# Altium project Mainboard.PrjPcb
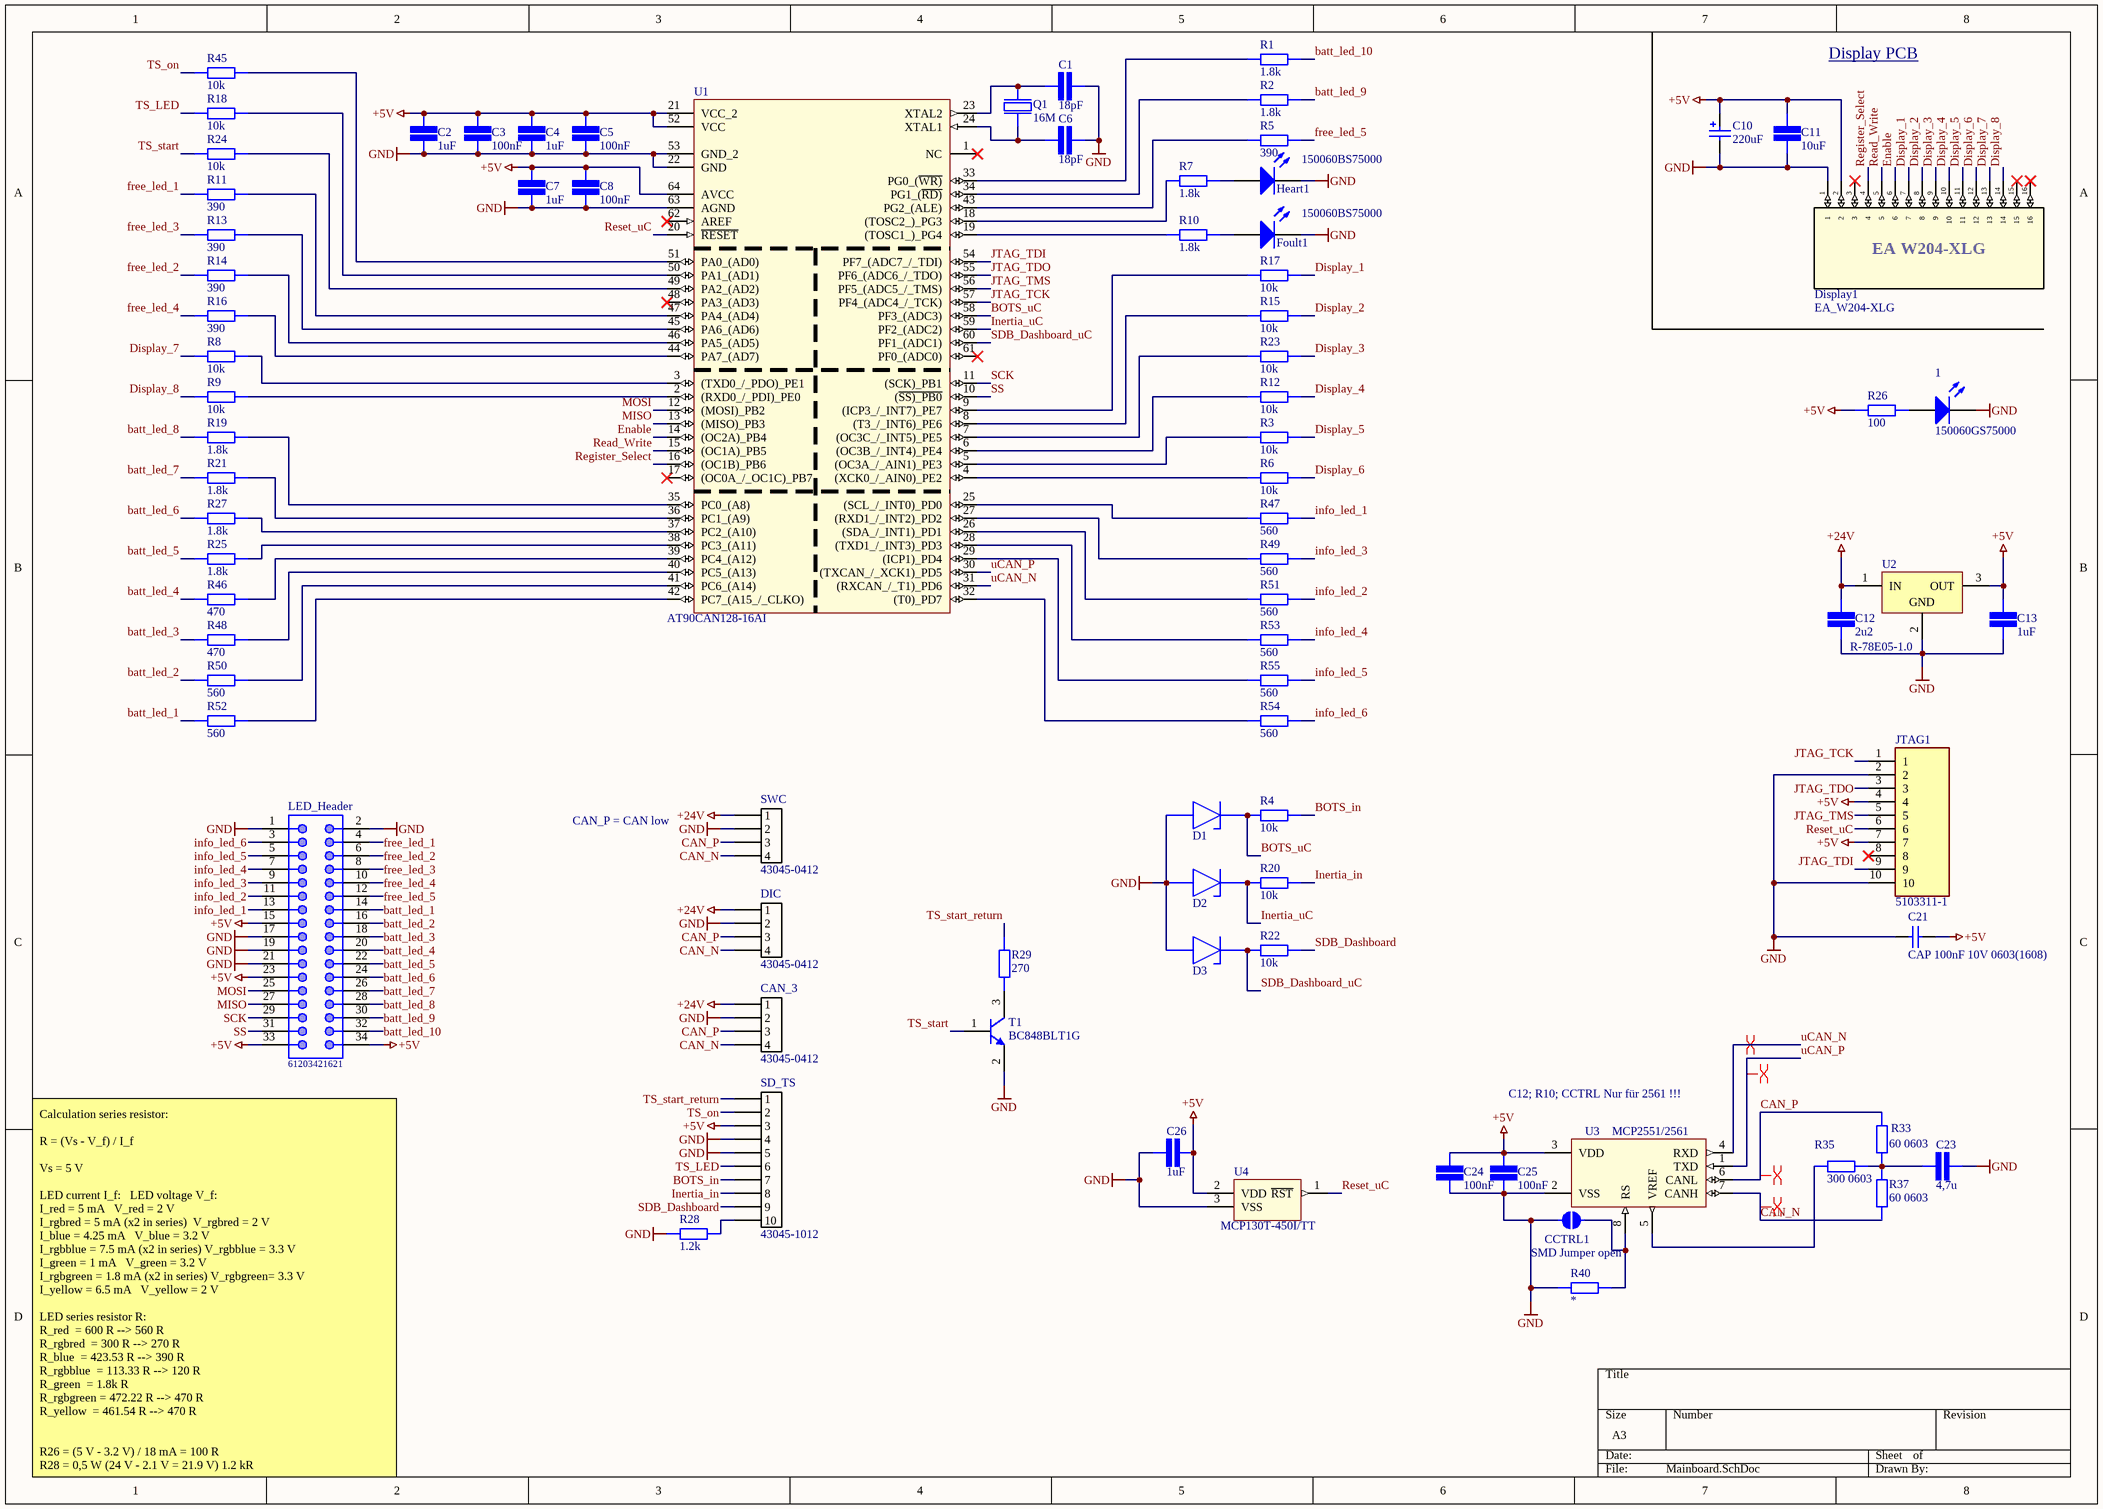
[diagram p0: Mainboard.SchDoc]
1 sheet, 81 parts. Net scope: global (net labels, ports and power ports of the same name join across sheets).
Board file: Mainboard.PcbDoc

## Sheet Mainboard.SchDoc
size A3; SheetNumber: 1; SheetTotal: 1

### Parts
1  150060GS75000  [0603_A]
C1  value 18pF  [CAP 0603/1608]  (hidden comment: SMD Capacitor)
C2  value 1uF  [CAP 0603/1608]  (hidden comment: SMD Capacitor)
C3  value 100nF  [CAP 0603/1608]  (hidden comment: SMD Capacitor)
C4  value 1uF  [CAP 0603/1608]  (hidden comment: SMD Capacitor)
C5  value 100nF  [CAP 0603/1608]  (hidden comment: SMD Capacitor)
C6  value 18pF  [CAP 0603/1608]  (hidden comment: SMD Capacitor)
C7  value 1uF  [CAP 0603/1608]  (hidden comment: SMD Capacitor)
C8  value 100nF  [CAP 0603/1608]  (hidden comment: SMD Capacitor)
C10  value 220uF  [WCAP-ASLL_6.3x7.7]  (hidden comment: 865060145006)
C11  value 10uF  [CAP 0603/1608]  (hidden comment: SMD Capacitor)
C12  value 2u2  [CAP 0603/1608]  (hidden comment: SMD Capacitor)
C13  value 1uF  [CAP 0603/1608]  (hidden comment: SMD Capacitor)
C21  CAP 100nF 10V 0603(1608)  [CAPC0603(1608)100_L]
C23  value 4,7u  [CAP 0603/1608]  (hidden comment: SMD Capacitor)
C24  value 100nF  [CAP 0603/1608]  (hidden comment: SMD Capacitor)
C25  value 100nF  [CAP 0603/1608]  (hidden comment: SMD Capacitor)
C26  value 1uF  [CAP 0603/1608]  (hidden comment: SMD Capacitor)
CAN_3  43045-0412  [43045-0412]
CCTRL1  SMD Jumper open  [SMD-JUMPER-OPEN]  (no BOM)
D1  MM3Z4V7T1G  [SOD-323-2]  (value not drawn)
D2  MM3Z4V7T1G  [SOD-323-2]  (value not drawn)
D3  MM3Z4V7T1G  [SOD-323-2]  (value not drawn)
DIC  43045-0412  [43045-0412]
Display1  EA_W204-XLG  [EA_W204-XLG]
Foult1  150060BS75000  [0603_A]
Heart1  150060BS75000  [0603_A]
JTAG1  5103311-1  [TE_5103311-1]
LED_Header  61203421621  [61203421621]
Q1  16M  [NDK NX5032GA]
R1  value 1.8k  [STACKPOLE CSR0603]  (hidden comment: SMD Resistor)
R2  value 1.8k  [STACKPOLE CSR0603]  (hidden comment: SMD Resistor)
R3  value 10k  [STACKPOLE CSR0603]  (hidden comment: SMD Resistor)
R4  value 10k  [STACKPOLE CSR0603]  (hidden comment: SMD Resistor)
R5  value 390  [STACKPOLE CSR0603]  (hidden comment: SMD Resistor)
R6  value 10k  [STACKPOLE CSR0603]  (hidden comment: SMD Resistor)
R7  value 1.8k  [STACKPOLE CSR0603]  (hidden comment: SMD Resistor)
R8  value 10k  [STACKPOLE CSR0603]  (hidden comment: SMD Resistor)
R9  value 10k  [STACKPOLE CSR0603]  (hidden comment: SMD Resistor)
R10  value 1.8k  [STACKPOLE CSR0603]  (hidden comment: SMD Resistor)
R11  value 390  [STACKPOLE CSR0603]  (hidden comment: SMD Resistor)
R12  value 10k  [STACKPOLE CSR0603]  (hidden comment: SMD Resistor)
R13  value 390  [STACKPOLE CSR0603]  (hidden comment: SMD Resistor)
R14  value 390  [STACKPOLE CSR0603]  (hidden comment: SMD Resistor)
R15  value 10k  [STACKPOLE CSR0603]  (hidden comment: SMD Resistor)
R16  value 390  [STACKPOLE CSR0603]  (hidden comment: SMD Resistor)
R17  value 10k  [STACKPOLE CSR0603]  (hidden comment: SMD Resistor)
R18  value 10k  [STACKPOLE CSR0603]  (hidden comment: SMD Resistor)
R19  value 1.8k  [STACKPOLE CSR0603]  (hidden comment: SMD Resistor)
R20  value 10k  [STACKPOLE CSR0603]  (hidden comment: SMD Resistor)
R21  value 1.8k  [STACKPOLE CSR0603]  (hidden comment: SMD Resistor)
R22  value 10k  [STACKPOLE CSR0603]  (hidden comment: SMD Resistor)
R23  value 10k  [STACKPOLE CSR0603]  (hidden comment: SMD Resistor)
R24  value 10k  [STACKPOLE CSR0603]  (hidden comment: SMD Resistor)
R25  value 1.8k  [STACKPOLE CSR0603]  (hidden comment: SMD Resistor)
R26  value 100  [STACKPOLE CSR0603]  (hidden comment: SMD Resistor)
R27  value 1.8k  [STACKPOLE CSR0603]  (hidden comment: SMD Resistor)
R28  value 1.2k  [STACKPOLE CSR0805]  (hidden comment: SMD Resistor)
R29  value 270  [STACKPOLE CSR0603]  (hidden comment: SMD Resistor)
R33  value 60 0603  [STACKPOLE CSR0603]  (hidden comment: SMD Resistor)
R35  value 300 0603  [STACKPOLE CSR0603]  (hidden comment: SMD Resistor)
R37  value 60 0603  [STACKPOLE CSR0603]  (hidden comment: SMD Resistor)
R40  SMD Resistor  [STACKPOLE CSR0603]  (value not drawn)
R45  value 10k  [STACKPOLE CSR0603]  (hidden comment: SMD Resistor)
R46  value 470  [STACKPOLE CSR0603]  (hidden comment: SMD Resistor)
R47  value 560  [STACKPOLE CSR0603]  (hidden comment: SMD Resistor)
R48  value 470  [STACKPOLE CSR0603]  (hidden comment: SMD Resistor)
R49  value 560  [STACKPOLE CSR0603]  (hidden comment: SMD Resistor)
R50  value 560  [STACKPOLE CSR0603]  (hidden comment: SMD Resistor)
R51  value 560  [STACKPOLE CSR0603]  (hidden comment: SMD Resistor)
R52  value 560  [STACKPOLE CSR0603]  (hidden comment: SMD Resistor)
R53  value 560  [STACKPOLE CSR0603]  (hidden comment: SMD Resistor)
R54  value 560  [STACKPOLE CSR0603]  (hidden comment: SMD Resistor)
R55  value 560  [STACKPOLE CSR0603]  (hidden comment: SMD Resistor)
SD_TS  43045-1012  [43045-1012]
SWC  43045-0412  [43045-0412]
T1  BC848BLT1G  [ONSC-SOT-23-3-318-08_V]
U1  AT90CAN128-16AI  [*QFP80P1600X1600X120-64N]
U2  R-78E05-1.0  [SIP3_RECOM]
U3  MCP2551/2561  [*SOIC127P600X175-8N]
U4  MCP130T-450I/TT  [*SOT95P237X112-3N]

### Nets
+5V: C2.2 C3.2 C4.2 C5.2 C7.2 C8.2 C10.1(P) C11.1 C13.2 C21.1 C24.2 C25.2 C26.1 Display1.2 JTAG1.4 JTAG1.7 LED_Header.15 LED_Header.23 LED_Header.33 LED_Header.34 R26.1 SD_TS.3 U1.21(VCC_2) U1.52(VCC) U1.64(AVCC) U2.3(OUT) U3.3(VDD) U4.2(VDD)
+24V: C12.2 CAN_3.1 DIC.1 SWC.1 U2.1(IN)
GND: 1.1(K) C1.1 C2.1 C3.1 C4.1 C5.1 C6.1 C7.1 C8.1 C10.2(N) C11.2 C12.1 C13.1 C21.2 C23.2 C24.1 C25.1 C26.2 CAN_3.2 CCTRL1.1 D1.2A(A) D2.2A(A) D3.2A(A) DIC.2 Display1.1 Foult1.1(K) Heart1.1(K) JTAG1.2 JTAG1.10 LED_Header.1 LED_Header.2 LED_Header.17 LED_Header.19 LED_Header.21 R28.2 R40.1 SD_TS.4 SD_TS.5 SWC.2 T1.2(E) U1.22(GND) U1.53(GND_2) U1.63(AGND) U2.2(GND) U3.2(VSS) U4.3(VSS)
batt_led_1: LED_Header.14 R52.1
batt_led_2: LED_Header.16 R50.1
batt_led_3: LED_Header.18 R48.1
batt_led_4: LED_Header.20 R46.1
batt_led_5: LED_Header.22 R25.2
batt_led_6: LED_Header.24 R27.2
batt_led_7: LED_Header.26 R21.1
batt_led_8: LED_Header.28 R19.1
batt_led_9: LED_Header.30 R2.1
batt_led_10: LED_Header.32 R1.1
BOTS_in: R4.1 SD_TS.7
BOTS_uC: D1.1C(C) R4.2 U1.58(PF3_(ADC3))
CAN_N: CAN_3.4 DIC.4 R37.2 SWC.4 U3.7(CANH)
CAN_P: CAN_3.3 DIC.3 R33.1 SWC.3 U3.6(CANL)
Display_1: Display1.7 R17.1
Display_2: Display1.8 R15.1
Display_3: Display1.9 R23.2
Display_4: Display1.10 R12.1
Display_5: Display1.11 R3.2
Display_6: Display1.12 R6.2
Display_7: Display1.13 R8.1
Display_8: Display1.14 R9.1
Enable: Display1.6 U1.14((OC2A)_PB4)
free_led_1: LED_Header.4 R11.2
free_led_2: LED_Header.6 R14.2
free_led_3: LED_Header.8 R13.2
free_led_4: LED_Header.10 R16.2
free_led_5: LED_Header.12 R5.1
Inertia_in: R20.1 SD_TS.8
Inertia_uC: D2.1C(C) R20.2 U1.59(PF2_(ADC2))
info_led_1: LED_Header.13 R47.2
info_led_2: LED_Header.11 R51.2
info_led_3: LED_Header.9 R49.1
info_led_4: LED_Header.7 R53.2
info_led_5: LED_Header.5 R55.2
info_led_6: LED_Header.3 R54.2
JTAG_TCK: JTAG1.1 U1.57(PF4_(ADC4_/_TCK))
JTAG_TDI: JTAG1.9 U1.54(PF7_(ADC7_/_TDI))
JTAG_TDO: JTAG1.3 U1.55(PF6_(ADC6_/_TDO))
JTAG_TMS: JTAG1.5 U1.56(PF5_(ADC5_/_TMS))
MISO: LED_Header.27 U1.13((MISO)_PB3)
MOSI: LED_Header.25 U1.12((MOSI)_PB2)
Read_Write: Display1.5 U1.15((OC1A)_PB5)
Register_Select: Display1.4 U1.16((OC1B)_PB6)
Reset_uC: JTAG1.6 U1.20(~{RESET}) U4.1(~{RST})
SCK: LED_Header.29 U1.11((SCK)_PB1)
SDB_Dashboard: R22.1 SD_TS.9
SDB_Dashboard_uC: D3.1C(C) R22.2 U1.60(PF1_(ADC1))
SS: LED_Header.31 U1.10((~{SS)_PB0})
TS_LED: R18.1 SD_TS.6
TS_on: R45.2 SD_TS.2
TS_start: R24.2 T1.1(B)
TS_start_return: R29.1 SD_TS.1
uCAN_N: U1.31((RXCAN_/_T1)_PD6) U3.4(RXD)
uCAN_P: U1.30((TXCAN_/_XCK1)_PD5) U3.1(TXD)
Net1_2: 1.2(A) R26.2
NetC1_2: C1.2 Q1.2 U1.23(XTAL2)
NetC6_2: C6.2 Q1.1 U1.24(XTAL1)
NetC23_1: C23.1 R33.2 R35.2 R37.1
NetCCTRL1_2: CCTRL1.2 R40.2 U3.8(RS)
NetFoult1_2: Foult1.2(A) R10.2
NetHeart1_2: Heart1.2(A) R7.2
NetR1_2: R1.2 U1.33(PG0_(~{WR)})
NetR2_2: R2.2 U1.34(PG1_(~{RD)})
NetR3_1: R3.1 U1.5((OC3A_/_AIN1)_PE3)
NetR5_2: R5.2 U1.43(PG2_(ALE))
NetR6_1: R6.1 U1.4((XCK0_/_AIN0)_PE2)
NetR7_1: R7.1 U1.18((TOSC2_)_PG3)
NetR8_2: R8.2 U1.3((TXD0_/_PDO)_PE1)
NetR9_2: R9.2 U1.2((RXD0_/_PDI)_PE0)
NetR10_1: R10.1 U1.19((TOSC1_)_PG4)
NetR11_1: R11.1 U1.47(PA4_(AD4))
NetR12_2: R12.2 U1.6((OC3B_/_INT4)_PE4)
NetR13_1: R13.1 U1.45(PA6_(AD6))
NetR14_1: R14.1 U1.46(PA5_(AD5))
NetR15_2: R15.2 U1.8((T3_/_INT6)_PE6)
NetR16_1: R16.1 U1.44(PA7_(AD7))
NetR17_2: R17.2 U1.9((ICP3_/_INT7)_PE7)
NetR18_2: R18.2 U1.50(PA1_(AD1))
NetR19_2: R19.2 U1.35(PC0_(A8))
NetR21_2: R21.2 U1.36(PC1_(A9))
NetR23_1: R23.1 U1.7((OC3C_/_INT5)_PE5)
NetR24_1: R24.1 U1.49(PA2_(AD2))
NetR25_1: R25.1 U1.38(PC3_(A11))
NetR27_1: R27.1 U1.37(PC2_(A10))
NetR28_1: R28.1 SD_TS.10
NetR29_2: R29.2 T1.3(C)
NetR35_1: R35.1 U3.5(VREF)
NetR45_1: R45.1 U1.51(PA0_(AD0))
NetR46_2: R46.2 U1.39(PC4_(A12))
NetR47_1: R47.1 U1.25((SCL_/_INT0)_PD0)
NetR48_2: R48.2 U1.40(PC5_(A13))
NetR49_2: R49.2 U1.27((RXD1_/_INT2)_PD2)
NetR50_2: R50.2 U1.41(PC6_(A14))
NetR51_1: R51.1 U1.26((SDA_/_INT1)_PD1)
NetR52_2: R52.2 U1.42(PC7_(A15_/_CLKO))
NetR53_1: R53.1 U1.28((TXD1_/_INT3)_PD3)
NetR54_1: R54.1 U1.32((T0)_PD7)
NetR55_1: R55.1 U1.29((ICP1)_PD4)

Not connected (* = marked no-connect by the designer): Display1 3* 15* 16*; JTAG1 8*; U1 1(NC)* 17((OC0A_/_OC1C)_PB7)* 48(PA3_(AD3))* 61(PF0_(ADC0))* 62(AREF)*

### Layout directives
differential pair: CAN_N, CAN_P, uCAN_N, uCAN_P

### Notes on the sheet
- Display PCB
- CAN_P = CAN low
- C12; R10; CCTRL Nur für 2561 !!!
- Calculation series resistor:
  R = (Vs - V_f) / I_f
  Vs = 5 V
  LED current I_f:			LED voltage V_f:
  I_red	= 5 mA			V_red	= 2 V
  I_rgbred	= 5 mA (x2 in series)		V_rgbred	= 2 V
  I_blue	= 4.25 mA			V_blue	= 3.2 V
  I_rgbblue	= 7.5 mA (x2 in series)	V_rgbblue	= 3.3 V
  I_green	= 1 mA			V_green	= 3.2 V
  I_rgbgreen	= 1.8 mA (x2 in series)	V_rgbgreen= 3.3 V
  I_yellow	= 6.5 mA			V_yellow	= 2 V
  LED series resistor R:
  R_red		= 600 R --> 560 R
  R_rgbred		= 300 R --> 270 R
  R_blue		= 423.53 R --> 390 R
  R_rgbblue		= 113.33 R --> 120 R
  R_green		= 1.8k R
  R_rgbgreen	= 472.22 R --> 470 R
  R_yellow		= 461.54 R --> 470 R
  R26 = (5 V - 3.2 V) / 18 mA = 100 R
  R28 = 0,5 W (24 V - 2.1 V = 21.9 V) 1.2 kR
- (in symbol EA_W204-XLG) EA W204-XLG

### Library data of the parts
1 = CMP-1426-00002-1: SMD mono-color Chip LED, WL-SMCW, Green; Manufacturer: Wuerth Elektronik; ComponentLink1URL: http://www.we-online.com; ComponentLink2Description: Datasheet; Color: Green; ComponentLink2URL: http://katalog.we-online.com/led/datasheet/150060GS75000.pdf; PartNumber: 150060GS75000; PackageReference: 0603_A; ComponentLink1Description: Manufacturer URL
C1-C8 C11-C13 C23-C26 = SMD Capacitor: Capacitor with multiple Footprints
C10 = 865060145006: WCAP-ASLL Aluminum Electrolytic Capacitors, size Ф6.3x7.7mm, 6.3V DC, 220uF; Rated Voltage: 6.3V DC; ComponentLink1Description: Manufacturer; ComponentLink1URL: http://www.we-online.de; ComponentLink2Description: Datasheet; ComponentLink2URL: http://katalog.we-online.de/pbs/datasheet/865060145006.pdf; Part Number: 865060145006; Published Date: June 2017; Publisher: Wurth Elektronik; Size: Ф6.3x7.7mm; Life Cycle: 2000h; Operating Temperature: -55 °C up to +105 °C
C21 = CMP-1035-02579-1: CAP 100nF 10V ±5% 0603 (1608 Metric) Thickness 1mm SMD; Tolerance: Â±5%; Case-EIA: 0603; Case-Metric: 1608; Value: 100nF; Max Thickness: 1 mm; Rated Voltage: 10 V; Technology: SMT
CAN_3 DIC SWC = 43045-0412: Micro-Fit 3.0 Vertical Header, 3.00mm Pitch, Dual Row, 4 Circuits, with PCB Polarizing Peg, Tin, Glow-Wire Capable, Black
D1-D3 = MM3Z4V7T1G: onsemi MM3Z4V7T1G / Z-Diode, 4,7V; ComponentLink1Description: Octopart; ComponentLink1URL: https://octopart.com/mm3z4v7t1g-onsemi-331144?r=sp
Display1 = EA_W204-XLG: Display
Foult1 Heart1 = CMP-1426-00003-1: SMD mono-color Chip LED, WL-SMCW, Blue; Manufacturer: Wuerth Elektronik; ComponentLink2Description: Datasheet; ComponentLink2URL: http://katalog.we-online.com/led/datasheet/150060BS75000.pdf; ComponentLink1URL: http://www.we-online.com; PackageReference: 0603_A; PartNumber: 150060BS75000; ComponentLink1Description: Manufacturer URL
  Foult1: Color: Red
  Heart1: Color: Blue
JTAG1 = 5103311-1: AMP-LATCH Pin Header, Low Profile, 10 Pos., Right Angle PCB Mount, .100 X .100; Centerline_Pitch: 2.54 mm[.1 in]; MF: TE Connectivity; Product_Type: Connector; Number_of_Positions: 10; Mouser-Purchase-URL: https://snapeda.com/shop?store=Mouser&id=619176; DigiKey-Purchase-URL: https://snapeda.com/shop?store=DigiKey&id=619176; Availability: Unavailable; EU_RoHS_Compliance: Compliant; Price: None; Arrow_Electronics-Purchase-URL: https://snapeda.com/shop?store=Arrow+Electronics&id=619176; MP: 5103311-1; Package: None; Value: *; SnapEDA_Link: https://www.snapeda.com/parts/5103311-1/TE%20Connectivity%20AMP%20Connectors/view-part/619176/?ref=snap; ComponentLink1Description: Datasheet; ComponentLink1URL: https://www.te.com/commerce/DocumentDelivery/DDEController?Action=showdoc&DocId=Catalog+Section%7F1307819_SECTION_5%7F0908%7Fpdf%7FEnglish%7FENG_CS_1307819_SECTION_5_0908.pdf%7F5103311-1
LED_Header = 61203421621: WR-BHD Box Header, Male PCB side, pitch 2.54mm, THT, Straight, 34p; Manufacturer: Wurth Elektronik; Working Voltage: 250VAC; Withstanding Voltage: 500VAC; Contact Resistance: 20mOhm; Pin Number: 34; Insulation Resistance: 1000MOhm; Rated Current: 3A; System: Connector; ComponentLink1Description: Manufacturer; ComponentLink1URL: http://www.we-online.de; ComponentLink2Description: Datasheet; ComponentLink2URL: https://www.we-online.com/catalog/datasheet/61203421621.pdf; Manufacturer Part Number: 61203421621; Published Date: August 2021; Pitch: 2.54mm; Operating Temperature: -40 to +105degC; Packaging: Tray; Gender: Male PCB side; Mounting Technology: THT; Type: Straight; Length: 50.84mm
Q1 = 16 MHz Quartz
R1 R2 R5 R11 R13 R14 R16 R19 R21 R25 R27 R46 R48 R50 R52 = SMD Resistor: Resistor with multiple footprints / 500R or 1kR depends on luminous intensity
R3 R4 R6-R10 R12 R15 R17 R18 R20 R22-R24 R26 R28 R29 R33 R35 R37 R40 R45 R47 R49 R51 R53-R55 = SMD Resistor: Resistor with multiple footprints
  R40: Value: *
SD_TS = 43045-1012: Micro-Fit 3.0 Vertical Header, 3.00mm Pitch, Dual Row, 10 Circuits, with PCB Polarizing Peg, Tin, Glow-Wire Capable, Black
T1 = CMP-1048-00679-1: General Purpose Transistor, NPN Silicon, 3-Pin SOT-23, Pb-Free, Tape and Reel; Manufacturer: On Semiconductor; fT Min (MHz): 100; IC Continuous (A): 0.1; DatasheetVersion: Rev. 11; PackageVersion: Rev. AP, 11/2009; RoHS: TRUE; PartNumber: BC848BLT1G; ComponentLink1Description: Manufacturer URL; PackageReference: SOT-23-3-318-08; ComponentLink3Description: Package Specification; ComponentLink1URL: http://www.onsemi.com/; Polarity: NPN; ComponentLink2Description: Datasheet; ComponentLink2URL: http://www.onsemi.cn/pub_link/Collateral/BC846ALT1-D.PDF; ComponentLink3URL: http://www.onsemi.cn/pub_link/Collateral/318-08.PDF; PackageDescription: 3-Pin Small Outline Transistor, Body 2.92 x 1.3 mm, Pitch 0.95 mm; Packing: Tape and Reel; Mounting Technology: Surface Mount; Manufacturer 1: ON Semiconductor; Manufacturer Part Number 1: BC848BLT1G
U1 = AT90CAN128-16AI: Ic Mcu 8bit 128kb Flash 64tqfp; MF: Microchip; MP: AT90CAN128-16AI; Package: TQFP-64 Microchip; SnapEDA_Link: https://www.snapeda.com/parts/AT90CAN128-16AI/Microchip/view-part/?ref=snap; Price: None; Availability: Unavailable; Value: *; ComponentLink1Description: Datasheet; ComponentLink1URL: https://ww1.microchip.com/downloads/en/DeviceDoc/doc7679.pdf
U2 = R-78E05-1.0: Nonisolated 5V Switchmode converter; ComponentLink1Description: Datasheet; ComponentLink1URL: https://recom-power.com/pdf/Innoline/R-78E-1.0.pdf
U3 = MCP2551-I/SN: MCP2551 Series 5.5 V 1 Mb/s Surface Mount High-Speed CAN Transceiver - SOIC-8; MF: Microchip; MP: MCP2551-I/SN; SnapEDA_Link: https://www.snapeda.com/parts/MCP2551-I/SN/Microchip/view-part/?ref=snap; Price: None; Package: SOIC-8 Microchip; Availability: Unavailable; Value: *; ComponentLink1Description: Datasheet; ComponentLink1URL: http://ww1.microchip.com/downloads/en/devicedoc/20001667g.pdf
U4 = MCP130T-450I/TT: System Supervisors - Power Supply Monitors with Reset Generators Open Drain Low; MF: Microchip; MP: MCP120T-450I/TT; Price: None; SnapEDA_Link: https://www.snapeda.com/parts/MCP120T-450I/TT/Microchip/view-part/?ref=snap; Package: SOT-23-3 Microchip; Availability: Unavailable; Value: *; ComponentLink1Description: Datasheet; ComponentLink1URL: https://ww1.microchip.com/downloads/en/DeviceDoc/11184d.pdf